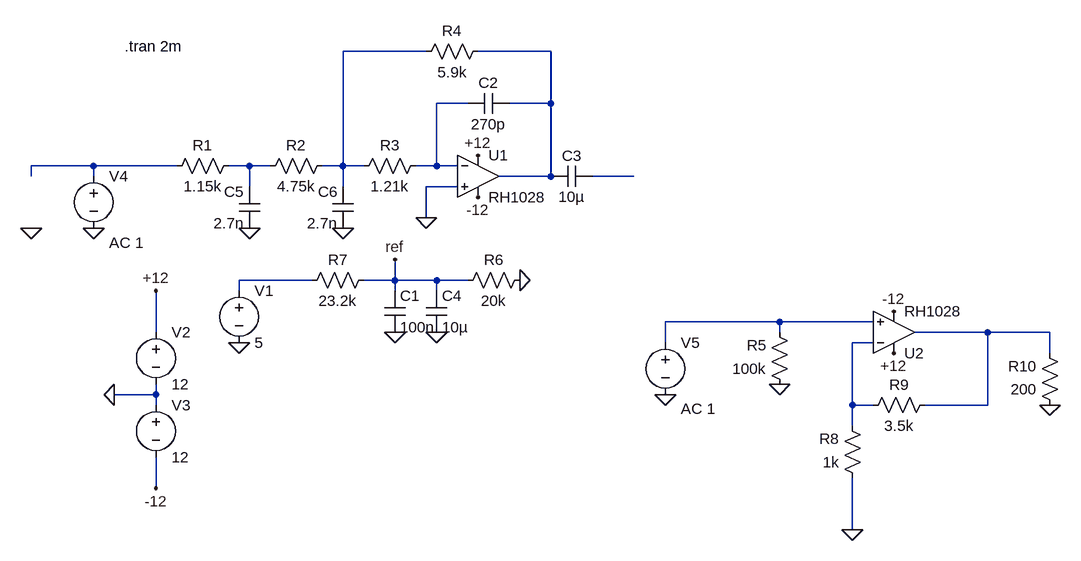
[diagram p0: schematic reconstructionfilt.asc]
reconstructionfilt.asc, the LTspice schematic file:
Version 4
SHEET 1 1540 704
WIRE 560 -48 432 -48
WIRE 752 -48 640 -48
WIRE 624 32 576 32
WIRE 752 32 752 -48
WIRE 752 32 688 32
WIRE 48 128 -48 128
WIRE 176 128 48 128
WIRE 288 128 256 128
WIRE 320 128 288 128
WIRE 432 128 432 -48
WIRE 432 128 400 128
WIRE 464 128 432 128
WIRE 576 128 576 32
WIRE 576 128 544 128
WIRE 608 128 576 128
WIRE -48 144 -48 128
WIRE 48 144 48 128
WIRE 752 144 752 32
WIRE 752 144 672 144
WIRE 880 144 816 144
WIRE 288 160 288 128
WIRE 432 160 432 128
WIRE 608 160 560 160
WIRE 560 208 560 160
WIRE 384 304 272 304
WIRE 512 304 512 272
WIRE 512 304 464 304
WIRE 576 304 512 304
WIRE 624 304 576 304
WIRE 272 320 272 304
WIRE 512 320 512 304
WIRE 576 320 576 304
WIRE 1104 368 928 368
WIRE 1248 368 1104 368
WIRE 144 384 144 320
WIRE 1104 384 1104 368
WIRE 1424 384 1312 384
WIRE 1520 384 1424 384
WIRE 928 400 928 368
WIRE 1248 400 1216 400
WIRE 1520 416 1520 384
WIRE 144 480 144 464
WIRE 144 480 80 480
WIRE 144 496 144 480
WIRE 1216 496 1216 400
WIRE 1248 496 1216 496
WIRE 1424 496 1424 384
WIRE 1424 496 1328 496
WIRE 1216 528 1216 496
WIRE 144 624 144 576
WIRE 1216 688 1216 608
FLAG 512 272 ref
FLAG 272 400 0
FLAG 512 384 0
FLAG 576 384 0
FLAG 704 304 0
FLAG 80 480 0
FLAG 144 320 +12
FLAG 144 624 -12
FLAG 1104 464 0
FLAG 288 224 0
FLAG 432 224 0
FLAG 48 224 0
FLAG 640 112 +12
FLAG 640 176 -12
FLAG 1280 416 +12
FLAG 1280 352 -12
FLAG 1216 688 0
FLAG -48 224 0
FLAG 560 208 0
FLAG 928 480 0
FLAG 1520 496 0
SYMBOL OpAmps/RH1028 640 80 R0
SYMATTR InstName U1
SYMBOL res 272 112 R90
WINDOW 0 0 56 VBottom 2
WINDOW 3 32 56 VTop 2
SYMATTR InstName R1
SYMATTR Value 1.15k
SYMBOL res 416 112 R90
WINDOW 0 0 56 VBottom 2
WINDOW 3 32 56 VTop 2
SYMATTR InstName R2
SYMATTR Value 4.75k
SYMBOL cap 496 320 R0
SYMATTR InstName C1
SYMATTR Value 100n
SYMBOL voltage 272 304 R0
SYMATTR InstName V1
SYMATTR Value 5
SYMBOL res 560 112 R90
WINDOW 0 0 56 VBottom 2
WINDOW 3 32 56 VTop 2
SYMATTR InstName R3
SYMATTR Value 1.21k
SYMBOL res 656 -64 R90
WINDOW 0 0 56 VBottom 2
WINDOW 3 32 56 VTop 2
SYMATTR InstName R4
SYMATTR Value 5.9k
SYMBOL res 1120 480 R180
WINDOW 0 36 76 Left 2
WINDOW 3 36 40 Left 2
SYMATTR InstName R5
SYMATTR Value 100k
SYMBOL cap 688 16 R90
WINDOW 0 0 32 VBottom 2
WINDOW 3 32 32 VTop 2
SYMATTR InstName C2
SYMATTR Value 270p
SYMBOL cap 816 128 R90
WINDOW 0 0 32 VBottom 2
WINDOW 3 32 32 VTop 2
SYMATTR InstName C3
SYMATTR Value 10µ
SYMBOL cap 560 320 R0
SYMATTR InstName C4
SYMATTR Value 10µ
SYMBOL res 608 320 R270
WINDOW 0 32 56 VTop 2
WINDOW 3 0 56 VBottom 2
SYMATTR InstName R6
SYMATTR Value 20k
SYMBOL res 368 320 R270
WINDOW 0 32 56 VTop 2
WINDOW 3 0 56 VBottom 2
SYMATTR InstName R7
SYMATTR Value 23.2k
SYMBOL voltage 144 368 R0
SYMATTR InstName V2
SYMATTR Value 12
SYMBOL voltage 144 480 R0
SYMATTR InstName V3
SYMATTR Value 12
SYMBOL cap 304 224 R180
WINDOW 0 24 56 Left 2
WINDOW 3 24 8 Left 2
SYMATTR InstName C5
SYMATTR Value 2.7n
SYMBOL cap 448 224 R180
WINDOW 0 24 56 Left 2
WINDOW 3 24 8 Left 2
SYMATTR InstName C6
SYMATTR Value 2.7n
SYMBOL voltage 48 128 R0
WINDOW 3 24 96 Invisible 2
WINDOW 123 24 118 Left 2
SYMATTR Value 2.5
SYMATTR Value2 AC 1
SYMATTR InstName V4
SYMATTR SpiceLine Rser=300
SYMBOL OpAmps/RH1028 1280 448 M180
SYMATTR InstName U2
SYMBOL res 1232 624 R180
WINDOW 0 36 76 Left 2
WINDOW 3 36 40 Left 2
SYMATTR InstName R8
SYMATTR Value 1k
SYMBOL res 1232 512 R270
WINDOW 0 32 56 VTop 2
WINDOW 3 0 56 VBottom 2
SYMATTR InstName R9
SYMATTR Value 3.5k
SYMBOL voltage 928 384 R0
WINDOW 3 24 96 Invisible 2
WINDOW 123 24 118 Left 2
SYMATTR Value SINE(0 1 500 0 0 0 100)
SYMATTR Value2 AC 1
SYMATTR InstName V5
SYMATTR SpiceLine Rser=300
SYMBOL res 1536 512 R180
WINDOW 0 36 76 Left 2
WINDOW 3 36 40 Left 2
SYMATTR InstName R10
SYMATTR Value 200
TEXT 96 -56 Left 2 !.tran 2m

The netlist it stands for:
* reconstructionfilt.asc
XU1 0 N003 +12 -12 N002 RH1028  ; pins In+ In- V+ V- OUT
R1 N005 N004 1.15k
R2 N001 N005 4.75k
C1 ref 0 100n
V1 N007 0 5
R3 N003 N001 1.21k
R4 N002 N001 5.9k
R5 0 N008 100k
C2 N002 N003 270p
C3 N006 N002 10µ
C4 ref 0 10µ
R6 ref 0 20k
R7 N007 ref 23.2k
V2 +12 0 12
V3 0 -12 12
C5 0 N005 2.7n
C6 0 N001 2.7n
V4 N004 0 2.5 AC 1 Rser=300
XU2 N008 N010 +12 -12 N009 RH1028  ; pins In+ In- V+ V- OUT
R8 0 N010 1k
R9 N010 N009 3.5k
V5 N008 0 SINE(0 1 500 0 0 0 100) AC 1 Rser=300
R10 0 N009 200
.tran 2m
.backanno
.end